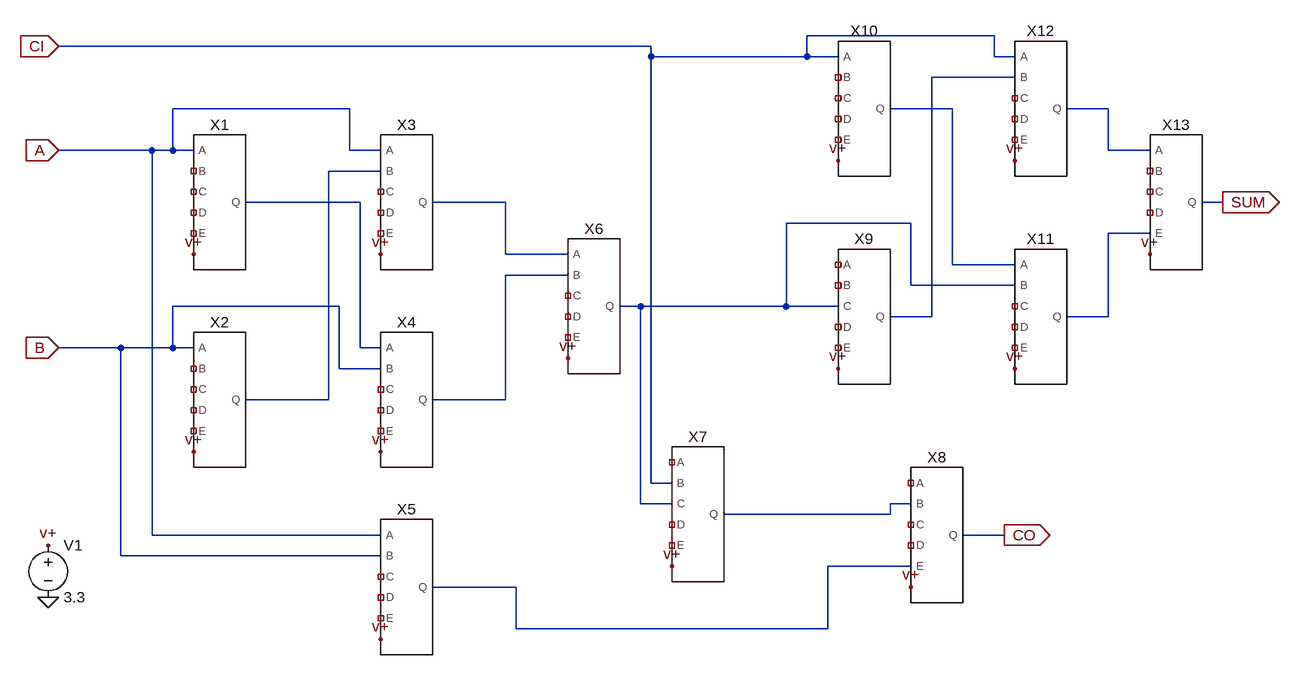
[diagram p0: schematic ALU1.asc]
ALU1.asc, the LTspice schematic file:
Version 4
SHEET 1 1660 896
WIRE 1216 -80 928 -80
WIRE 688 -64 -224 -64
WIRE 688 -48 688 -64
WIRE 928 -48 928 -80
WIRE 928 -48 688 -48
WIRE 976 -48 928 -48
WIRE 1216 -48 1216 -80
WIRE 1248 -48 1216 -48
WIRE 1248 -16 1120 -16
WIRE 224 32 -48 32
WIRE 1152 32 1056 32
WIRE 1392 32 1328 32
WIRE -80 96 -224 96
WIRE -48 96 -48 32
WIRE -48 96 -80 96
WIRE -16 96 -48 96
WIRE 224 96 224 32
WIRE 272 96 224 96
WIRE 1392 96 1392 32
WIRE 1456 96 1392 96
WIRE 272 128 192 128
WIRE 240 176 64 176
WIRE 464 176 352 176
WIRE 1568 176 1536 176
WIRE 1088 208 896 208
WIRE 1456 224 1392 224
WIRE 464 256 464 176
WIRE 560 256 464 256
WIRE 1152 272 1152 32
WIRE 1248 272 1152 272
WIRE 560 288 464 288
WIRE 1088 304 1088 208
WIRE 1248 304 1088 304
WIRE 208 336 -48 336
WIRE 672 336 640 336
WIRE 896 336 896 208
WIRE 896 336 672 336
WIRE 976 336 896 336
WIRE 1120 352 1120 -16
WIRE 1120 352 1056 352
WIRE 1392 352 1392 224
WIRE 1392 352 1328 352
WIRE -128 400 -224 400
WIRE -48 400 -48 336
WIRE -48 400 -128 400
WIRE -16 400 -48 400
WIRE 240 400 240 176
WIRE 272 400 240 400
WIRE 208 432 208 336
WIRE 272 432 208 432
WIRE 192 480 192 128
WIRE 192 480 64 480
WIRE 464 480 464 288
WIRE 464 480 352 480
WIRE 688 608 688 -48
WIRE 720 608 688 608
WIRE 672 640 672 336
WIRE 720 640 672 640
WIRE 1088 640 1056 640
WIRE 1056 656 1056 640
WIRE 1056 656 800 656
WIRE -80 688 -80 96
WIRE 272 688 -80 688
WIRE 1232 688 1168 688
WIRE -128 720 -128 400
WIRE 272 720 -128 720
WIRE 1088 736 960 736
WIRE 480 768 352 768
WIRE 480 832 480 768
WIRE 960 832 960 736
WIRE 960 832 480 832
FLAG -16 256 v+
FLAG -16 560 v+
FLAG 272 256 v+
FLAG 272 560 v+
FLAG 272 848 v+
FLAG 560 416 v+
FLAG -224 96 A
IOPIN -224 96 In
FLAG -224 400 B
IOPIN -224 400 In
FLAG 720 736 v+
FLAG 1088 768 v+
FLAG 976 432 v+
FLAG 976 112 v+
FLAG 1248 432 v+
FLAG 1248 112 v+
FLAG 1456 256 v+
FLAG 1568 176 SUM
IOPIN 1568 176 Out
FLAG 1232 688 CO
IOPIN 1232 688 Out
FLAG -224 -64 CI
IOPIN -224 -64 In
FLAG -240 784 0
FLAG -240 704 v+
SYMBOL Nand5Clamp 16 176 R0
SYMATTR InstName X1
SYMBOL Nand5Clamp 16 480 R0
SYMATTR InstName X2
SYMBOL Nand5Clamp 304 176 R0
SYMATTR InstName X3
SYMBOL Nand5Clamp 304 480 R0
SYMATTR InstName X4
SYMBOL Nand5Clamp 304 768 R0
SYMATTR InstName X5
SYMBOL Nand5Clamp 592 336 R0
SYMATTR InstName X6
SYMBOL Nand5Clamp 752 656 R0
SYMATTR InstName X7
SYMBOL Nand5Clamp 1120 688 R0
SYMATTR InstName X8
SYMBOL Nand5Clamp 1008 352 R0
SYMATTR InstName X9
SYMBOL Nand5Clamp 1008 32 R0
SYMATTR InstName X10
SYMBOL Nand5Clamp 1280 352 R0
SYMATTR InstName X11
SYMBOL Nand5Clamp 1280 32 R0
SYMATTR InstName X12
SYMBOL Nand5Clamp 1488 176 R0
SYMATTR InstName X13
SYMBOL voltage -240 688 R0
SYMATTR InstName V1
SYMATTR Value 3.3

The netlist it stands for:
* ALU1.asc
XX1 A NC_01 NC_02 NC_03 NC_04 N005 Nand5Clamp  ; pins A B C D E Q
XX2 B NC_05 NC_06 NC_07 NC_08 N004 Nand5Clamp  ; pins A B C D E Q
XX3 A N004 NC_09 NC_10 NC_11 N006 Nand5Clamp  ; pins A B C D E Q
XX4 N005 B NC_12 NC_13 NC_14 N009 Nand5Clamp  ; pins A B C D E Q
XX5 A B NC_15 NC_16 NC_17 N011 Nand5Clamp  ; pins A B C D E Q
XX6 N006 N009 NC_18 NC_19 NC_20 N007 Nand5Clamp  ; pins A B C D E Q
XX7 NC_21 CI N007 NC_22 NC_23 N010 Nand5Clamp  ; pins A B C D E Q
XX8 NC_24 N010 NC_25 NC_26 N011 CO Nand5Clamp  ; pins A B C D E Q
XX9 NC_27 NC_28 N007 NC_29 NC_30 N001 Nand5Clamp  ; pins A B C D E Q
XX10 CI NC_31 NC_32 NC_33 NC_34 N002 Nand5Clamp  ; pins A B C D E Q
XX11 N002 N007 NC_35 NC_36 NC_37 N008 Nand5Clamp  ; pins A B C D E Q
XX12 CI N001 NC_38 NC_39 NC_40 N003 Nand5Clamp  ; pins A B C D E Q
XX13 N003 NC_41 NC_42 NC_43 N008 SUM Nand5Clamp  ; pins A B C D E Q
V1 v+ 0 3.3
.backanno
.end